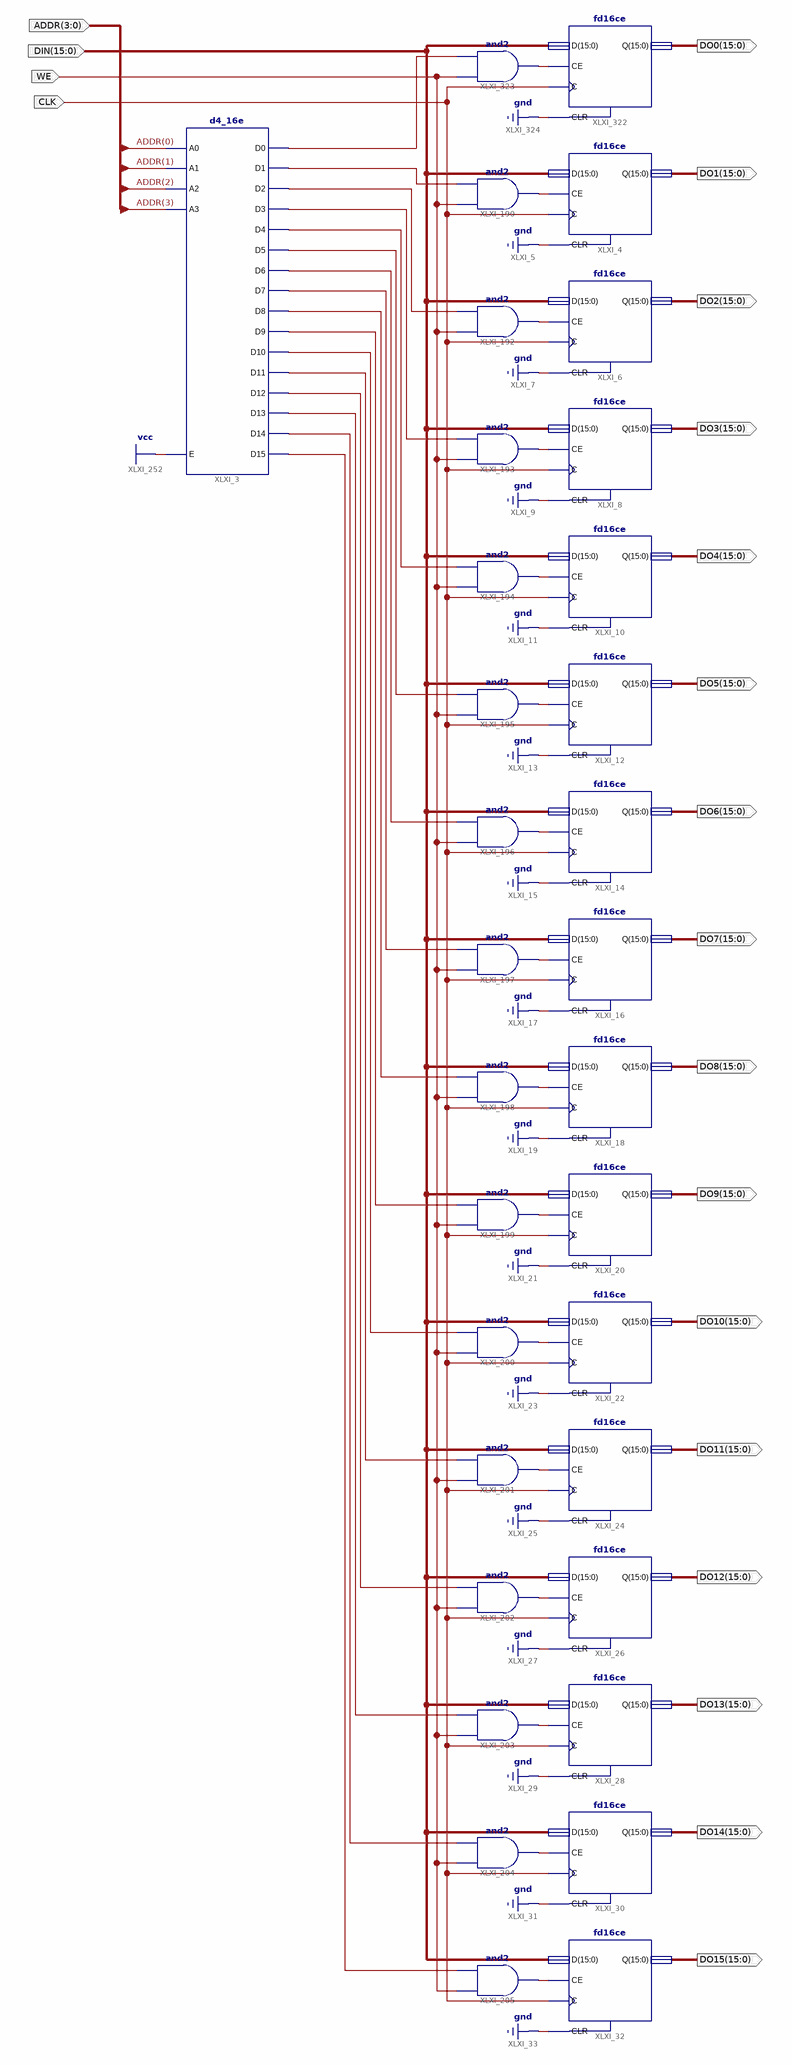
[diagram p0: schematic sheet 1]
// Xilinx ISE schematic oregs.sch (spartan6) as structural Verilog: 33 symbols, 20 ports
module oregs (
  input  [15:0] DIN,
  input  [3:0] ADDR,
  input  CLK,
  input  WE,
  output [15:0] DO1,
  output [15:0] DO2,
  output [15:0] DO3,
  output [15:0] DO4,
  output [15:0] DO5,
  output [15:0] DO6,
  output [15:0] DO7,
  output [15:0] DO8,
  output [15:0] DO9,
  output [15:0] DO10,
  output [15:0] DO11,
  output [15:0] DO12,
  output [15:0] DO13,
  output [15:0] DO14,
  output [15:0] DO15,
  output [15:0] DO0
);

  wire XLXN_132, XLXN_135, XLXN_136, XLXN_137, XLXN_138, XLXN_139, XLXN_140, XLXN_141, XLXN_142, XLXN_143,
       XLXN_144, XLXN_145, XLXN_146, XLXN_147, XLXN_148, XLXN_230, XLXN_231, XLXN_232, XLXN_233, XLXN_234,
       XLXN_235, XLXN_236, XLXN_237, XLXN_238, XLXN_239, XLXN_240, XLXN_241, XLXN_242, XLXN_243, XLXN_244,
       XLXN_422, XLXN_423;

  d4_16e XLXI_3 (
    .A0(ADDR[0]), .A1(ADDR[1]), .A2(ADDR[2]), .A3(ADDR[3]), .E(1'b1), .D0(XLXN_422), .D1(XLXN_230),
    .D10(XLXN_239), .D11(XLXN_240), .D12(XLXN_241), .D13(XLXN_242), .D14(XLXN_243), .D15(XLXN_244),
    .D2(XLXN_231), .D3(XLXN_232), .D4(XLXN_233), .D5(XLXN_234), .D6(XLXN_235), .D7(XLXN_236), .D8(XLXN_237),
    .D9(XLXN_238));
  fd16ce XLXI_4 (.C(CLK), .CE(XLXN_132), .CLR(1'b0), .D(DIN), .Q(DO1));
  fd16ce XLXI_6 (.C(CLK), .CE(XLXN_135), .CLR(1'b0), .D(DIN), .Q(DO2));
  fd16ce XLXI_8 (.C(CLK), .CE(XLXN_136), .CLR(1'b0), .D(DIN), .Q(DO3));
  fd16ce XLXI_10 (.C(CLK), .CE(XLXN_137), .CLR(1'b0), .D(DIN), .Q(DO4));
  fd16ce XLXI_12 (.C(CLK), .CE(XLXN_138), .CLR(1'b0), .D(DIN), .Q(DO5));
  fd16ce XLXI_14 (.C(CLK), .CE(XLXN_139), .CLR(1'b0), .D(DIN), .Q(DO6));
  fd16ce XLXI_16 (.C(CLK), .CE(XLXN_140), .CLR(1'b0), .D(DIN), .Q(DO7));
  fd16ce XLXI_18 (.C(CLK), .CE(XLXN_141), .CLR(1'b0), .D(DIN), .Q(DO8));
  fd16ce XLXI_20 (.C(CLK), .CE(XLXN_142), .CLR(1'b0), .D(DIN), .Q(DO9));
  fd16ce XLXI_22 (.C(CLK), .CE(XLXN_143), .CLR(1'b0), .D(DIN), .Q(DO10));
  fd16ce XLXI_24 (.C(CLK), .CE(XLXN_144), .CLR(1'b0), .D(DIN), .Q(DO11));
  fd16ce XLXI_26 (.C(CLK), .CE(XLXN_145), .CLR(1'b0), .D(DIN), .Q(DO12));
  fd16ce XLXI_28 (.C(CLK), .CE(XLXN_146), .CLR(1'b0), .D(DIN), .Q(DO13));
  fd16ce XLXI_30 (.C(CLK), .CE(XLXN_147), .CLR(1'b0), .D(DIN), .Q(DO14));
  fd16ce XLXI_32 (.C(CLK), .CE(XLXN_148), .CLR(1'b0), .D(DIN), .Q(DO15));
  and XLXI_190 (XLXN_132, WE, XLXN_230);
  and XLXI_192 (XLXN_135, WE, XLXN_231);
  and XLXI_193 (XLXN_136, WE, XLXN_232);
  and XLXI_194 (XLXN_137, WE, XLXN_233);
  and XLXI_195 (XLXN_138, WE, XLXN_234);
  and XLXI_196 (XLXN_139, WE, XLXN_235);
  and XLXI_197 (XLXN_140, WE, XLXN_236);
  and XLXI_198 (XLXN_141, WE, XLXN_237);
  and XLXI_199 (XLXN_142, WE, XLXN_238);
  and XLXI_200 (XLXN_143, WE, XLXN_239);
  and XLXI_201 (XLXN_144, WE, XLXN_240);
  and XLXI_202 (XLXN_145, WE, XLXN_241);
  and XLXI_203 (XLXN_146, WE, XLXN_242);
  and XLXI_204 (XLXN_147, WE, XLXN_243);
  and XLXI_205 (XLXN_148, WE, XLXN_244);
  fd16ce XLXI_322 (.C(CLK), .CE(XLXN_423), .CLR(1'b0), .D(DIN), .Q(DO0));
  and XLXI_323 (XLXN_423, WE, XLXN_422);
endmodule
